# Altium schematic sheet CON_RELAYx4_KMRJIO3_5MM_12WAY.SchDoc: Screw Header For Relays
size A4; Organization: Altium Limited.; Address1: Level 3, 12a Rodborough Rd; Address2: Frenchs Forest 2086; Address3: NSW; Address4: AUSTRALIA; DocumentNumber: 12; SheetNumber: 13; SheetTotal: 77
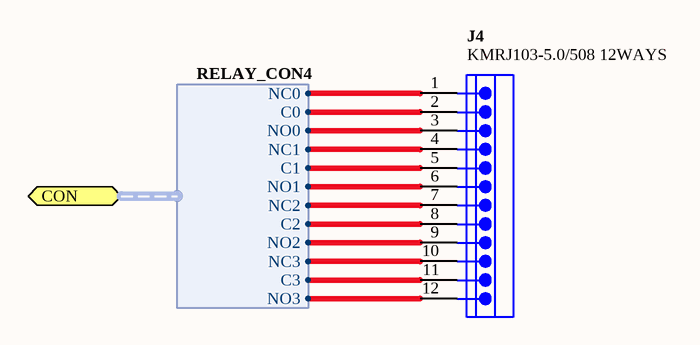
[diagram p0: CON_RELAYx4_KMRJIO3_5MM_12WAY.SchDoc]

## Parts
J4  KMRJ103-5.0/508 12WAYS  [KMRJ103-5-508-12]

## Ports
CON (harness RELAY_CON4)

## Harnesses
RELAY_CON4: NO0, C0, NC0, NO1, C1, NC1, NO2, C2, NC2, NO3, C3, NC3

## Nets
NetJ4_1: J4.1 ; port CON.NC0
NetJ4_2: J4.2 ; port CON.C0
NetJ4_3: J4.3 ; port CON.NO0
NetJ4_4: J4.4 ; port CON.NC1
NetJ4_5: J4.5 ; port CON.C1
NetJ4_6: J4.6 ; port CON.NO1
NetJ4_7: J4.7 ; port CON.NC2
NetJ4_8: J4.8 ; port CON.C2
NetJ4_9: J4.9 ; port CON.NO2
NetJ4_10: J4.10 ; port CON.NC3
NetJ4_11: J4.11 ; port CON.C3
NetJ4_12: J4.12 ; port CON.NO3

## Notes on the sheet
- Sheet Title
- Project Title
- Size:
- Date:
- A4
- Assy:
- Time:
- Revision:
- Sheet
- of
- File:

## Library data of the parts
J4 = D-300-0123: Socket, Screw Terminal Block, 12 Way, 5.0mm pitch, 45 degree angle, Through-hole; Connector type: Header; Max Current: 300V/10A A; Mounting Technology: Through-Hole; Pin Count: 12; Status: Unreleased; Category: Connector